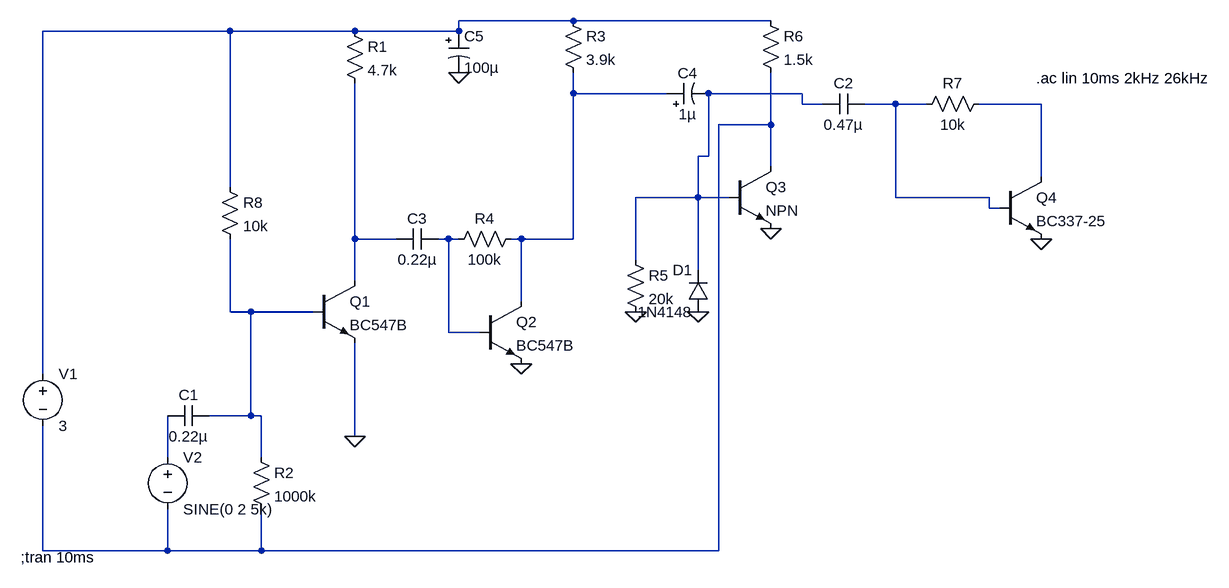
[diagram p0: schematic spy device.asc]
spy device.asc, the LTspice schematic file:
Version 4
SHEET 1 1508 680
WIRE 208 -208 32 -208
WIRE 512 -208 208 -208
WIRE -320 -192 -608 -192
WIRE -128 -192 -320 -192
WIRE 32 -192 32 -208
WIRE 32 -192 -128 -192
WIRE 208 -96 208 -128
WIRE 352 -96 208 -96
WIRE 560 -96 416 -96
WIRE 560 -80 560 -96
WIRE 592 -80 560 -80
WIRE 704 -80 656 -80
WIRE 752 -80 704 -80
WIRE 928 -80 832 -80
WIRE 512 -48 512 -128
WIRE 512 -48 432 -48
WIRE 416 0 416 -96
WIRE 416 0 400 0
WIRE 512 16 512 -48
WIRE 928 32 928 -80
WIRE -320 48 -320 -192
WIRE 400 64 400 0
WIRE 400 64 304 64
WIRE 448 64 400 64
WIRE 704 64 704 -80
WIRE 848 64 704 64
WIRE 848 80 848 64
WIRE 864 80 848 80
WIRE -128 128 -128 -112
WIRE -64 128 -128 128
WIRE 16 128 0 128
WIRE 32 128 16 128
WIRE 128 128 112 128
WIRE 208 128 208 -96
WIRE 208 128 128 128
WIRE 304 160 304 64
WIRE 400 176 400 64
WIRE -128 192 -128 128
WIRE 128 224 128 128
WIRE -320 240 -320 128
WIRE -288 240 -320 240
WIRE -192 240 -288 240
WIRE 16 272 16 128
WIRE 64 272 16 272
WIRE -608 336 -608 -192
WIRE -288 400 -288 240
WIRE -288 400 -352 400
WIRE -272 400 -288 400
WIRE -128 432 -128 288
WIRE -416 464 -416 400
WIRE -272 464 -272 400
WIRE -608 608 -608 416
WIRE -416 608 -416 544
WIRE -416 608 -608 608
WIRE -272 608 -272 544
WIRE -272 608 -416 608
WIRE 432 608 432 -48
WIRE 432 608 -272 608
FLAG -128 432 0
FLAG 32 -128 0
FLAG 128 320 0
FLAG 304 240 0
FLAG 400 240 0
FLAG 512 112 0
FLAG 928 128 0
SYMBOL res -144 -208 R0
SYMATTR InstName R1
SYMATTR Value 4.7k
SYMBOL res -288 448 R0
SYMATTR InstName R2
SYMATTR Value 1000k
SYMBOL res 192 -224 R0
SYMATTR InstName R3
SYMATTR Value 3.9k
SYMBOL res 128 112 R90
WINDOW 0 0 56 VBottom 2
WINDOW 3 32 56 VTop 2
SYMATTR InstName R4
SYMATTR Value 100k
SYMBOL res 288 144 R0
SYMATTR InstName R5
SYMATTR Value 20k
SYMBOL res 496 -224 R0
SYMATTR InstName R6
SYMATTR Value 1.5k
SYMBOL res 848 -96 R90
WINDOW 0 0 56 VBottom 2
WINDOW 3 32 56 VTop 2
SYMATTR InstName R7
SYMATTR Value 10k
SYMBOL cap -352 384 R90
WINDOW 0 0 32 VBottom 2
WINDOW 3 32 32 VTop 2
SYMATTR InstName C1
SYMATTR Value 0.22µ
SYMBOL cap 656 -96 R90
WINDOW 0 0 32 VBottom 2
WINDOW 3 32 32 VTop 2
SYMATTR InstName C2
SYMATTR Value 0.47µ
SYMBOL cap 0 112 R90
WINDOW 0 0 32 VBottom 2
WINDOW 3 32 32 VTop 2
SYMATTR InstName C3
SYMATTR Value 0.22µ
SYMBOL polcap 352 -80 R270
WINDOW 0 32 32 VTop 2
WINDOW 3 0 32 VBottom 2
SYMATTR InstName C4
SYMATTR Value 1µ
SYMATTR SpiceLine V=10
SYMBOL npn -192 192 R0
SYMATTR InstName Q1
SYMATTR Value BC547B
SYMBOL polcap 16 -192 R0
SYMATTR InstName C5
SYMATTR Value 100µ
SYMATTR SpiceLine V=10
SYMBOL npn 64 224 R0
SYMATTR InstName Q2
SYMATTR Value BC547B
SYMBOL npn 448 16 R0
SYMATTR InstName Q3
SYMBOL diode 416 240 R180
WINDOW 0 24 64 Left 2
WINDOW 3 24 0 Left 2
SYMATTR InstName D1
SYMATTR Value 1N4148
SYMBOL npn 864 32 R0
SYMATTR InstName Q4
SYMATTR Value BC337-25
SYMBOL res -336 32 R0
SYMATTR InstName R8
SYMATTR Value 10k
SYMBOL voltage -608 320 R0
WINDOW 123 0 0 Left 0
WINDOW 39 0 0 Left 0
SYMATTR InstName V1
SYMATTR Value 3
SYMBOL voltage -416 448 R0
WINDOW 123 0 0 Left 0
WINDOW 39 0 0 Left 0
SYMATTR InstName V2
SYMATTR Value SINE(0 2 5k)
TEXT -642 618 Left 2 !;tran 10ms
TEXT 920 -120 Left 2 !.ac lin 10ms 2kHz 26kHz

The netlist it stands for:
* spy device.asc
R1 N001 N007 4.7k
R2 N009 N006 1000k
R3 N001 N002 3.9k
R4 N002 N008 100k
R5 N003 0 20k
R6 N001 N006 1.5k
R7 N005 N004 10k
C1 N009 N010 0.22µ
C2 N004 N003 0.47µ
C3 N008 N007 0.22µ
C4 N002 N003 1µ V=10
Q1 N007 N009 0 0 BC547B
C5 N001 0 100µ V=10
Q2 N002 N008 0 0 BC547B
Q3 N006 N003 0 0 NPN
D1 0 N003 1N4148
Q4 N005 N004 0 0 BC337-25
R8 N001 N009 10k
V1 N001 N006 3
V2 N010 N006 SINE(0 2 5k)
.model D D
.lib standard.dio
.model NPN NPN
.model PNP PNP
.lib standard.bjt
;tran 10ms
.ac lin 10ms 2kHz 26kHz
.backanno
.end